# EAGLE design dual supply (EAGLE 9.6.2)
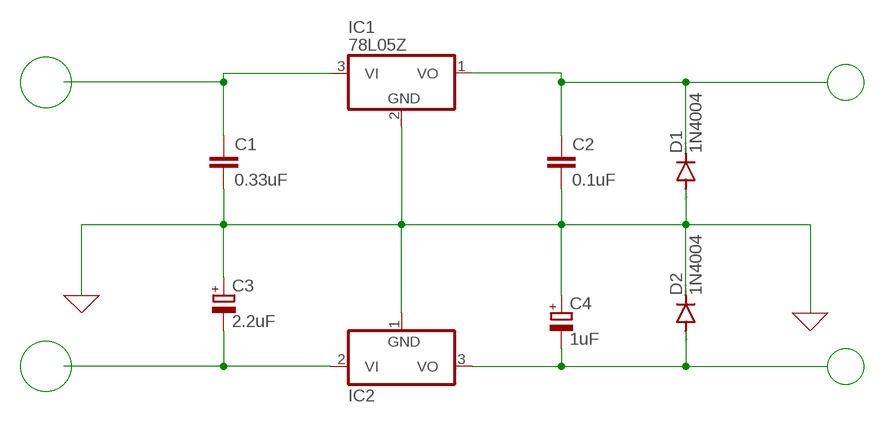
[diagram p0: schematic, sheet 1]

## Parts
C1  0.33uF  C2,5-3  [C2.5-3]
C2  0.1uF  C2,5-3  [C2.5-3]
C3  2.2uF  CPOL-EU085CS-1AR  [085CS_1AR]
C4  1uF  CPOL-EU085CS-1AR  [085CS_1AR]
D1  1N4004  [DO41-10]
D2  1N4004  [DO41-10]
IC1  78L05Z  [TO92]
IC2  79L05Z  [TO92]

## Nets
0: C1.2 C2.2 C3.+ C4.+ D1.A D2.C IC1.2(GND) IC2.1(GND) ; supply symbol labelled GND
N$1: C2.1 D1.C IC1.1(VO)
N$2: C1.1 IC1.3(VI)
N$3: C4.- D2.A IC2.3(VO)
N$4: C3.- IC2.2(VI)

## Library data of the parts
C1 C2 = capacitor-wima:C: CAPACITOR naming: grid - package width
C3 C4 = rcl:CPOL-EU: POLARIZED CAPACITOR, European symbol; SPICEPREFIX: C
D1 D2 = diode:1N4004: DIODE general purpose rectifier, 1 A
IC1 = linear:78*: Positive VOLTAGE REGULATOR Source: http://cache.national.com/ds/LM/LM78L05.pdf http://www.fairchildsemi.com/ds/LM/LM7805.pdf
IC2 = linear:79*: Negative VOLTAGE REGULATOR

## Board
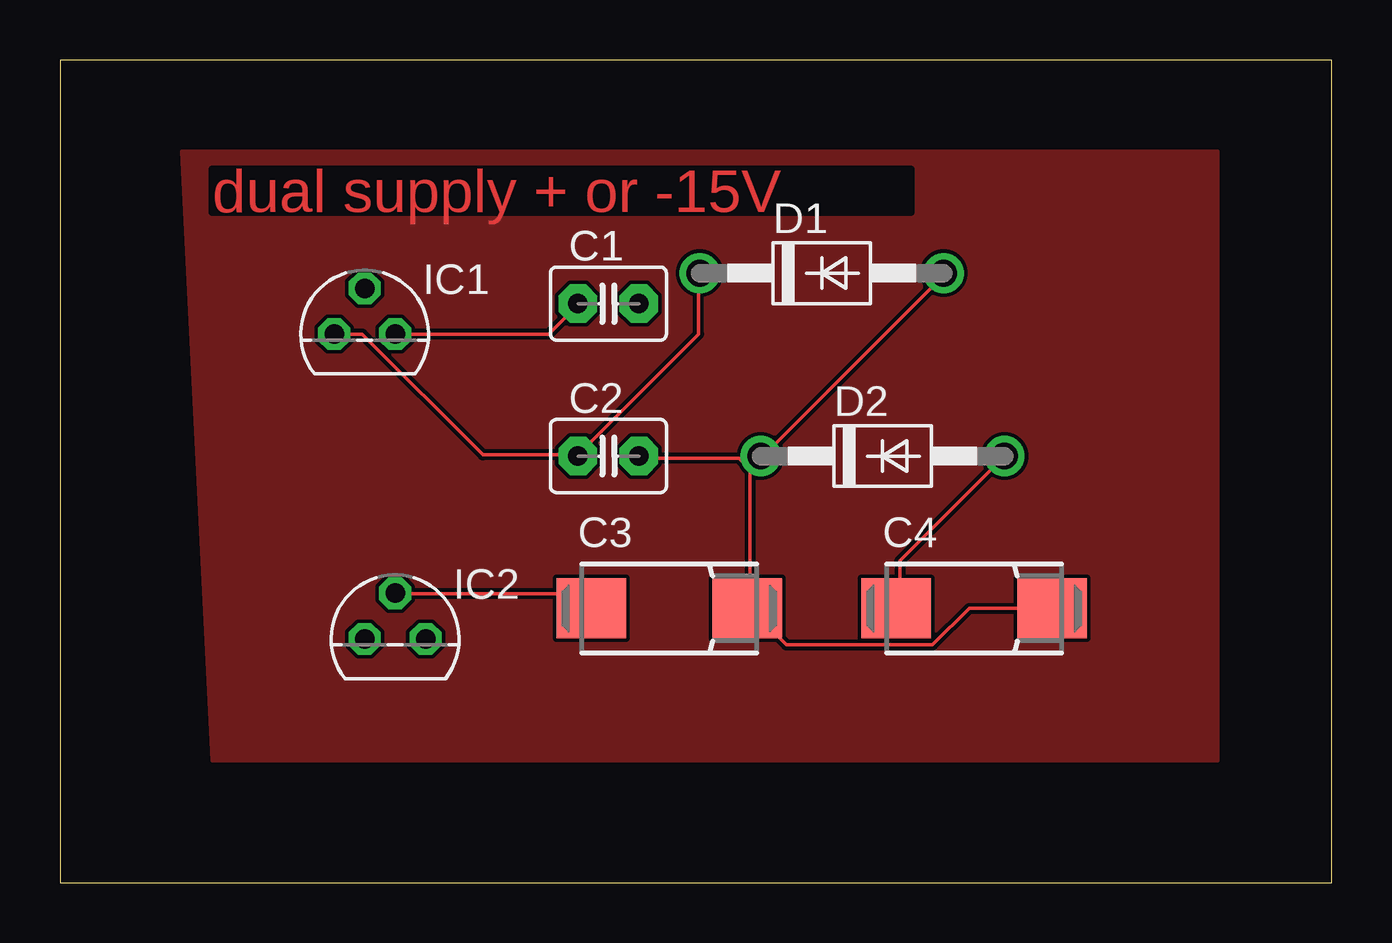
[diagram p1: board, top side]
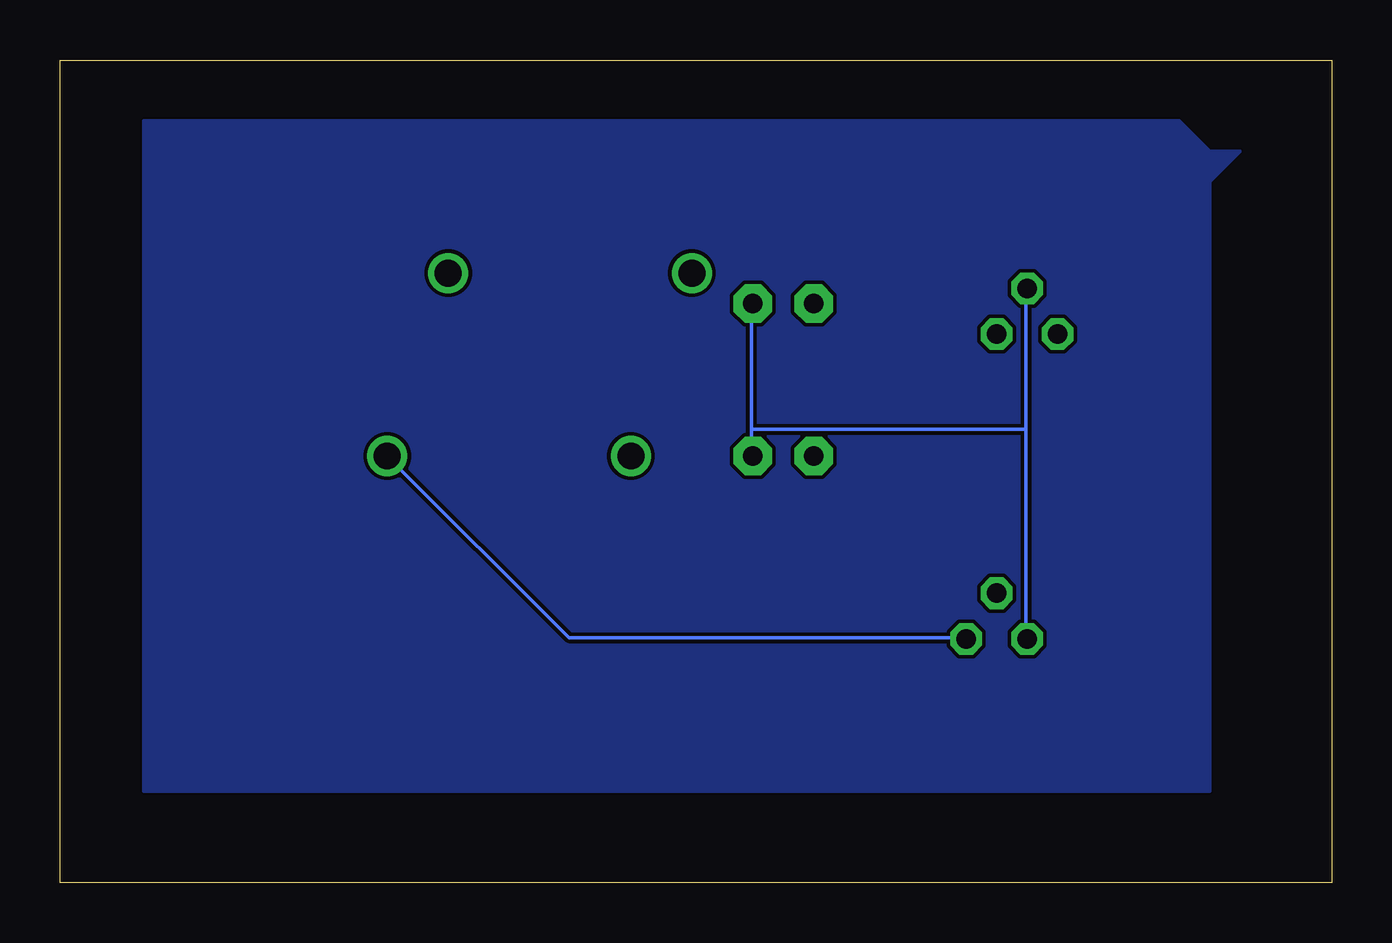
[diagram p2: board, bottom side, seen from below]

Size 53.01 x 34.28 mm. Coordinates in mm from the lower left corner, seen from the top.
Outline: 0,0 53.01,0 53.01,34.28 0,34.28 0,0
Copper layers (1*16): Top 0.035mm / dielectric 1.5mm / Bottom 0.035mm
Design rules "default": minimum track width 6mil, minimum drill 0.35mm, track to track 6mil, track to pad 6mil, pad to pad 6mil, via to via 6mil, smd to smd 6mil, copper to edge 40mil, drill to drill 6mil, minimum pad ring 10mil, minimum via ring 8mil, stop-mask expansion 4mil, vias tented up to drill 0mil, thermal gap 10mil

### Footprints (pad centres in the part's own frame; a part is rotated, then mirrored left to right if it is on the bottom)
C2.5-3 = drill 0.813 pad 1.6 octagon: 1 -1.27,0; 2 1.27,0
085CS_1AR = smd 2.9 x 2.5: + 3.25,0; - -3.25,0
DO41-10 = drill 1.118: A 5.08,0; C -5.08,0
TO92 = drill 0.813 octagon: 1 -1.27,0; 2 0,1.905; 3 1.27,0

### Placement (x,y rotation side)
C1  22.86,24.13 0 top
C2  22.86,17.78 0 top
C3  25.4,11.43 0 top
C4  38.1,11.43 0 top
D1  31.75,25.4 0 top
D2  34.29,17.78 0 top
IC1  12.7,22.86 0 top
IC2  13.97,10.16 0 top

### Tracks (layer width: path | path; a pad name or v marks a point on that pad's centre or on a via)
0
  Top 0.152: 28.75,17.22 28.75,11.43 | 29.21,17.68 28.75,17.22 | C4.+ 37.9,11.43 36.37,9.91 30.28,9.91 28.75,11.43 | 28.75,11.43 C3.+ | 28.75,17.22 28.3,17.68 24.18,17.68 C2.2 | 28.75,17.22 D2.C 29.21,17.68 | 29.21,17.68 36.83,25.3 D1.A
  Bottom 0.152: 12.75,18.9 12.75,24.69 IC1.2 | 12.75,18.9 12.75,10.21 IC2.1 | 24.18,18.9 24.18,17.83 C2.2 | 24.18,18.9 24.18,24.08 C1.2 | 24.18,18.9 12.75,18.9
K
  pour Top: 5.08,30.48 48.26,30.48 48.26,5.08 6.35,5.08
  pour Bottom: 3.81,30.48 5.08,29.21 5.08,3.81 49.53,3.81 49.53,31.75 6.35,31.75 5.08,30.48
N$1
  Top 0.152: IC1.1 12.6,22.86 17.63,17.83 21.59,17.83 | 21.59,17.83 26.62,22.86 26.62,25.3 D1.C | 21.59,17.83 C2.1
N$2
  Top 0.152: IC1.3 20.37,22.86 21.59,24.08 C1.1
N$3
  Top 0.152: D2.A 35,13.41 35,11.43 C4.-
  Bottom 0.152: D2.A 31.8,10.21 15.34,10.21 IC2.3
N$4
  Top 0.152: IC2.2 13.97,12.04 21.44,12.04 22.05,11.43 C3.-

### Text on the board
Top: dual supply + or -15V